# Altium schematic sheet power.SchDoc: =GlobalProjectName
size 209 x 297 mm; ApprovedBy: Утвердил; CheckedBy: Проверил; Author: Разработал; SheetNumber: 1; SheetTotal: 9; PageSetup: Record=PageOptions|CenterHorizontal=True|CenterVertical=True|PrintScale=1.00|XCorrection=1.00|YCorrection=1.00|PrintKind=1|BorderSize=5000000|LeftOffset=0|BottomOffset=0|Orientation=2|PaperLength=1000|PaperWidth=1000|Scale=100|PaperSource=15|PrintQuality=1200|MediaType=1|DitherType=10|PaperKind=A3|PrintScaleMode=1; Weight: -; ScaleFactor: -; NormInspection: Норм.Контр.
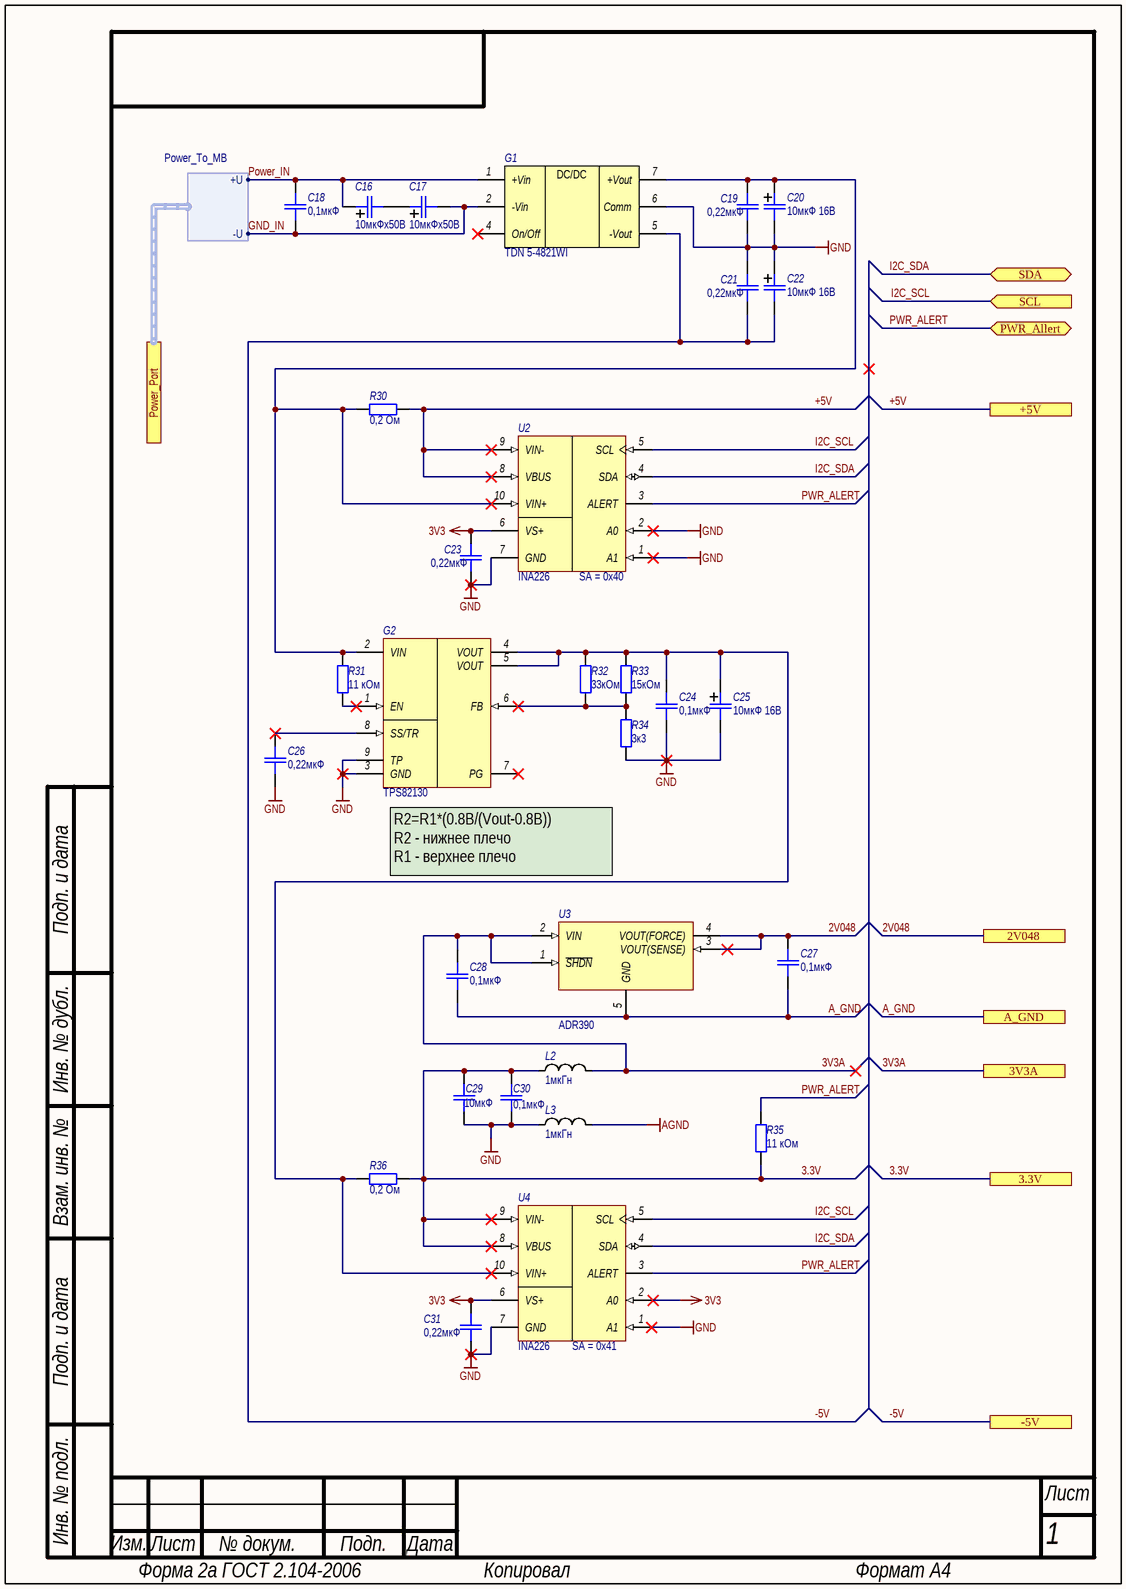
[diagram p0: power.SchDoc]

## Parts
C16  10мкФх50В  [SMD_size_C]
C17  10мкФх50В  [SMD_size_C]
C18  0,1мкФ  [SMD_0805]
C19  0,22мкФ  [SMD_0805]
C20  10мкФ 16В  [SMD_size_B]
C21  0,22мкФ  [SMD_0805]
C22  10мкФ 16В  [SMD_size_B]
C23  0,22мкФ  [SMD_0805]
C24  0,1мкФ  [SMD_0805]
C25  10мкФ 16В  [SMD_size_B]
C26  0,22мкФ  [SMD_0805]
C27  0,1мкФ  [SMD_0805]
C28  0,1мкФ  [SMD_0805]
C29  10мкФ  [SMD_0805]
C30  0,1мкФ  [SMD_0805]
C31  0,22мкФ  [SMD_0805]
G1  Наименование: TDN 5-4821WI  [TDN_5_WISM]  (hidden comment: TDN 5-4821)
G2  TPS82130  [uSiL-8]
L2  1мкГн  [SMD_0805]
L3  1мкГн  [SMD_0805]
R30  0,2 Ом  [SMD_0805]
R31  11 кОм  [SMD_0805]
R32  33кОм  [SMD_0805]
R33  15кОм  [SMD_0805]
R34  3к3  [SMD_0805]
R35  11 кОм  [SMD_0805]
R36  0,2 Ом  [SMD_0805]
U2  INA261  [VSSOP-10]  (value not drawn)
U3  ADR390  [TSOT-5]
U4  INA261  [VSSOP-10]  (value not drawn)

## Ports
2V048, 3.3V, 3V3A, +5V, -5V, A_GND, Power_Port (harness Power_To_MB), PWR_Allert (bidir), SCL (in), SDA (bidir)

## Harnesses
Power_To_MB: +U, -U

## Nets
3V3: C23.2 C31.2 U2.6(VS+) U4.2(A0) U4.6(VS+)
AGND: L3.2
GND: C19.1 C20.2 C21.2 C22.1 C23.1 C24.1 C25.2 C26.1 C29.1 C30.1 C31.1 G1.6(Comm) G2.3(GND) G2.9(TP) L3.1 R34.1 U2.1(A1) U2.2(A0) U2.7(GND) U4.1(A1) U4.7(GND)
2V048: C27.2 U3.3(VOUT(SENSE)) U3.4(VOUT(FORCE)) ; port 2V048
3.3V: C29.2 C30.2 L2.1 R35.1 R36.2 U4.8(VBUS) U4.9(VIN-) ; port 3.3V
3V3A: C28.2 L2.2 U3.1(~{SHDN}) U3.2(VIN) ; port 3V3A
+5V: R30.2 U2.8(VBUS) U2.9(VIN-) ; port +5V
-5V: C21.1 C22.2 G1.5(-Vout) ; port -5V
A_GND: C27.1 C28.1 U3.5(GND) ; port A_GND
GND_IN: C17.2 C18.1 G1.2(-Vin) ; port Power_Port.-U
I2C_SCL: U2.5(SCL) U4.5(SCL) ; port SCL
I2C_SDA: U2.4(SDA) U4.4(SDA) ; port SDA
Power_IN: C16.1 C18.2 G1.1(+Vin) ; port Power_Port.+U
PWR_ALERT: R35.2 U2.3(ALERT) U4.3(ALERT) ; port PWR_Allert
NetC16_2: C16.2 C17.1
NetC19_2: C19.2 C20.1 G1.7(+Vout) G2.2(VIN) R30.1 R31.2 U2.10(VIN+)
NetC24_2: C24.2 C25.1 G2.4(VOUT) G2.5(VOUT) R32.2 R33.2 R36.1 U4.10(VIN+)
NetC26_2: C26.2 G2.8(SS/TR)
NetG2_1: G2.1(EN) R31.1
NetG2_6: G2.6(FB) R32.1 R33.1 R34.2

Not connected (* = marked no-connect by the designer): G1 4(On/Off)*; G2 7(PG)*

## Notes on the sheet
- (near U2) SA = 0x40
- (near G2) R2=R1*(0.8В/(Vout-0.8B))
  R2 - нижнее плечо
  R1 - верхнее плечо
- (near U4) SA = 0x41
- Подп. и дата
- Инв. № дубл.
- Взам. инв. №
- Инв. № подл.
- Изм.
- Лист
- № докум.
- Подп.
- Дата
- Форма 2а ГОСТ 2.104-2006
- Копировал
- Формат А4
- (in symbol TDN_5) DC/DC

## Library data of the parts
C16 C17 = Capacitor_pol: Polarized capacitor; Назначение: Поляризованный SMD-конденсатор; Наименование: Поляризованный конденсатор; Потребление, Вт: 0; Value: 10мкФх50В
C18 C24 C27 C28 C30 = Capacitor: Назначение: SMD-конденсатор; Наименование: Конденсатор; Потребление, Вт: 0; Value: 0,1мкФ
C19 C21 C23 C26 C29 C31 = Capacitor: Назначение: SMD-конденсатор; Наименование: Конденсатор; Потребление, Вт: 0; Value: 0,1мкФ
C20 C22 C25 = Capacitor_pol: Polarized capacitor; Назначение: Поляризованный SMD-конденсатор; Наименование: Поляризованный конденсатор; Потребление, Вт: 0; Value: 10мкФх50В
G1 = TDN_5: DC/DC converter; Назначение: DC-DC преобразователь; Потребление, Вт: 0,01; DataSheet: https://www.tracopower.com/sites/default/files/products/datasheets/tdn5wi_datasheet.pdf
G2 = TPS82130: 17-V Input 3-A Step-Down Converter MicroSiP™ Module with Integrated Inductor; Потребление, Вт: 1,0; ComponentLink1Description: Data sheet; ComponentLink1URL: http://www.ti.com/lit/ds/symlink/tps82130.pdf; Назначение: 17-V Input 3-A Step-Down Converter MicroSiP™ Module with Integrated Inductor; DataSheet: https://www.ti.com/lit/ds/symlink/tps82130.pdf?ts=1592813288219&ref_url=https%253A%252F%252Fwww.google.com%252F; Наименование: TPS82130
L2 L3 = Inductor: Наименование: Индуктивность; Назначение: SMD-индуктивность; Потребление, Вт: 0,010; Value: 1мкГн
R30-R36 = Resistor: Наименование: Резистор; Назначение: SMD-резистор; Потребление, Вт: 0,001; Value: 1к
U2 U4 = INA226: High- or Low-Side Measurement, Bidirectional Current and Power Monitor With I2C Interface; Назначение: High-Side or Low-Side Measurement,; Потребление, Вт: 0,001; ComponentLink1Description: Data sheet; ComponentLink1URL: http://www.ti.com/lit/ds/symlink/ina226.pdf; DataSheet: https://www.ti.com/lit/ds/symlink/ina226.pdf?ts=1592809211957&ref_url=https%253A%252F%252Fwww.google.com%252F; Наименование: INA226
U3 = ADR390: Micropower, Low Noise Precision Voltage Reference with Shutdown, 2.5 V Output, 2.8 to 15 V Supply, Industrial, 5-pin SOT23 (UJ-5), Reel; Потребление, Вт: 0,001; Назначение: Источник опорного напряжения; Наименование: ADR390; DataSheet: https://www.analog.com/media/en/technical-documentation/data-sheets/ADR390.pdf